# EAGLE design controller (EAGLE 6.1)
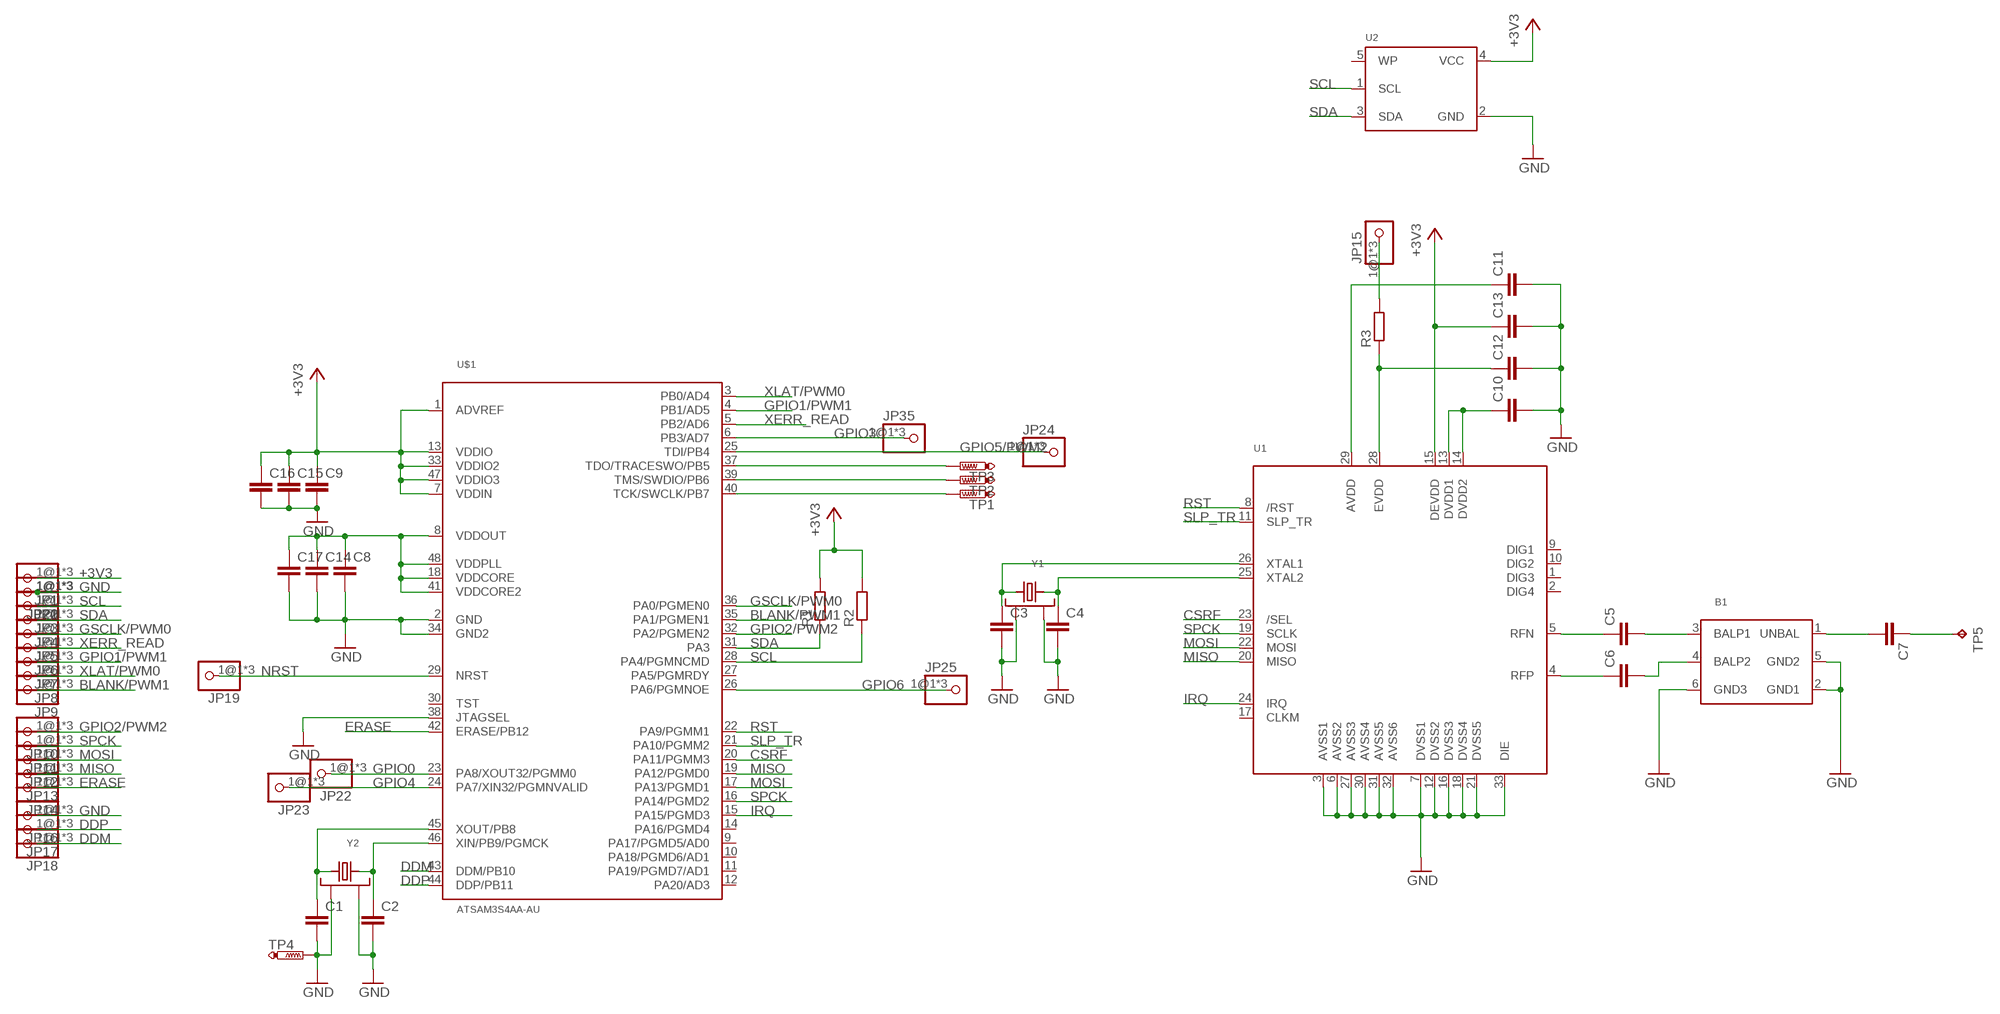
[diagram p0: schematic, sheet 1]

## Parts
B1  BALUN+LP  [BALUN0805]
C1  C-EUC0402K  [C0402K]
C2  C-EUC0402K  [C0402K]
C3  C-EUC0402K  [C0402K]
C4  C-EUC0402K  [C0402K]
C5  C-EUC0402K  [C0402K]
C6  C-EUC0402K  [C0402K]
C7  C-EUC0402K  [C0402K]
C8  C-EUC0603K  [C0603K]
C9  C-EUC0603K  [C0603K]
C10  C-EUC0603K  [C0603K]
C11  C-EUC0603K  [C0603K]
C12  C-EUC0603K  [C0603K]
C13  C-EUC0603K  [C0603K]
C14  C-EUC0603K  [C0603K]
C15  C-EUC0603K  [C0603K]
C16  C-EUC0603K  [C0603K]
C17  C-EUC0805K  [C0805K]
JP1  HEADER-1X1PAD  [1MMPAD]
JP2  HEADER-1X1PAD  [1MMPAD]
JP3  HEADER-1X1PAD  [1MMPAD]
JP4  HEADER-1X1PAD  [1MMPAD]
JP5  HEADER-1X1PAD  [1MMPAD]
JP6  HEADER-1X1PAD  [1MMPAD]
JP7  HEADER-1X1PAD  [1MMPAD]
JP8  HEADER-1X1PAD  [1MMPAD]
JP9  HEADER-1X1PAD  [1MMPAD]
JP10  HEADER-1X1PAD  [1MMPAD]
JP11  HEADER-1X1PAD  [1MMPAD]
JP12  HEADER-1X1PAD  [1MMPAD]
JP13  HEADER-1X1PAD  [1MMPAD]
JP14  HEADER-1X1PAD  [1MMPAD]
JP15  HEADER-1X1PAD  [1MMPAD]
JP16  HEADER-1X1PAD  [1MMPAD]
JP17  HEADER-1X1PAD  [1MMPAD]
JP18  HEADER-1X1PAD  [1MMPAD]
JP19  HEADER-1X1PAD  [1MMPAD]
JP20  HEADER-1X1PAD  [1MMPAD]
JP21  HEADER-1X1PAD  [1MMPAD]
JP22  HEADER-1X1PAD  [1MMPAD]
JP23  HEADER-1X1PAD  [1MMPAD]
JP24  HEADER-1X1PAD  [1MMPAD]
JP25  HEADER-1X1PAD  [1MMPAD]
JP35  HEADER-1X1PAD  [1MMPAD]
R1  R-EU_R0402  [R0402]
R2  R-EU_R0402  [R0402]
R3  R-EU_R0805  [R0805]
TP1  PTR1TP15R  [TP15R]
TP2  PTR1TP15R  [TP15R]
TP3  PTR1TP15R  [TP15R]
TP4  PTR1TP15R  [TP15R]
TP5  TPTP15SQ  [TP15SQ]
U1  AT86RF212  [32QN2]
U2  MCP24AA32  [SOT23-5]
U$1  ATSAM3S4AA-AU  [LQFP48]
Y1  CRYSTALTHIN  [CRYSTAL_3.2X2.5]
Y2  CRYSTALTHIN  [CRYSTAL_3.2X2.5]

## Nets
+3V3: C9.1 C13.1 C15.1 C16.1 JP1.1@1 JP1.1@2 JP1.1@3 R1.2 R2.2 U1.15(DEVDD) U2.4(VCC) U$1.1(ADVREF) U$1.7(VDDIN) U$1.13(VDDIO) U$1.33(VDDIO2) U$1.47(VDDIO3)
ANT: C7.1 TP5.TP
BLANK/PWM1: JP9.1@1 JP9.1@2 JP9.1@3 U$1.35(PA1/PGMEN1)
CSRF: U1.23(/SEL) U$1.20(PA11/PGMM3)
DDM: JP18.1@1 JP18.1@2 JP18.1@3 U$1.43(DDM/PB10)
DDP: JP17.1@1 JP17.1@2 JP17.1@3 U$1.44(DDP/PB11)
ERASE: JP14.1@1 JP14.1@2 JP14.1@3 U$1.42(ERASE/PB12)
GND: B1.2(GND1) B1.5(GND2) B1.6(GND3) C1.2 C2.2 C3.2 C4.2 C8.2 C9.2 C10.2 C11.2 C12.2 C13.2 C14.2 C15.2 C16.2 C17.2 JP2.1@1 JP2.1@2 JP2.1@3 JP16.1@1 JP16.1@2 JP16.1@3 JP20.1@1 JP20.1@2 JP20.1@3 JP21.1@1 JP21.1@2 JP21.1@3 TP4.TP U1.3(AVSS1) U1.6(AVSS2) U1.7(DVSS1) U1.12(DVSS2) U1.16(DVSS3) U1.18(DVSS4) U1.21(DVSS5) U1.27(AVSS3) U1.30(AVSS4) U1.31(AVSS5) U1.32(AVSS6) U1.33(DIE) U2.2(GND) U$1.2(GND) U$1.34(GND2) U$1.38(JTAGSEL) Y1.GND1 Y1.GND2 Y2.GND1 Y2.GND2
GPIO0: JP22.1@1 JP22.1@2 JP22.1@3 U$1.23(PA8/XOUT32/PGMM0)
GPIO1/PWM1: JP7.1@1 JP7.1@2 JP7.1@3 U$1.4(PB1/AD5)
GPIO2/PWM2: JP10.1@1 JP10.1@2 JP10.1@3 U$1.32(PA2/PGMEN2)
GPIO3: JP35.1@1 JP35.1@2 JP35.1@3 U$1.6(PB3/AD7)
GPIO4: JP23.1@1 JP23.1@2 JP23.1@3 U$1.24(PA7/XIN32/PGMNVALID)
GPIO5/PWM2: JP24.1@1 JP24.1@2 JP24.1@3 U$1.25(TDI/PB4)
GPIO6: JP25.1@1 JP25.1@2 JP25.1@3 U$1.26(PA6/PGMNOE)
GSCLK/PWM0: JP5.1@1 JP5.1@2 JP5.1@3 U$1.36(PA0/PGMEN0)
IRQ: U1.24(IRQ) U$1.15(PA15/PGMD3)
MISO: JP13.1@1 JP13.1@2 JP13.1@3 U1.20(MISO) U$1.19(PA12/PGMD0)
MOSI: JP12.1@1 JP12.1@2 JP12.1@3 U1.22(MOSI) U$1.17(PA13/PGMD1)
N$1: C5.1 U1.5(RFN)
N$2: B1.3(BALP1) C5.2
N$3: C6.1 U1.4(RFP)
N$4: B1.4(BALP2) C6.2
N$5: C1.1 U$1.45(XOUT/PB8) Y2.2
N$6: C2.1 U$1.46(XIN/PB9/PGMCK) Y2.1
N$7: B1.1(UNBAL) C7.2
N$9: C3.1 U1.26(XTAL1) Y1.2
N$10: C4.1 U1.25(XTAL2) Y1.1
N$13: C12.1 R3.1 U1.28(EVDD)
N$14: C8.1 C14.1 C17.1 U$1.8(VDDOUT) U$1.18(VDDCORE) U$1.41(VDDCORE2) U$1.48(VDDPLL)
N$15: C11.1 U1.29(AVDD)
N$16: JP15.1@1 JP15.1@2 JP15.1@3 R3.2
N$18: C10.1 U1.13(DVDD1) U1.14(DVDD2)
N$26: TP1.TP U$1.40(TCK/SWCLK/PB7)
N$27: TP2.TP U$1.39(TMS/SWDIO/PB6)
N$28: TP3.TP U$1.37(TDO/TRACESWO/PB5)
NRST: JP19.1@1 JP19.1@2 JP19.1@3 U$1.29(NRST)
RST: U1.8(/RST) U$1.22(PA9/PGMM1)
SCL: JP3.1@1 JP3.1@2 JP3.1@3 R2.1 U2.1(SCL) U$1.28(PA4/PGMNCMD)
SDA: JP4.1@1 JP4.1@2 JP4.1@3 R1.1 U2.3(SDA) U$1.31(PA3)
SLP_TR: U1.11(SLP_TR) U$1.21(PA10/PGMM2)
SPCK: JP11.1@1 JP11.1@2 JP11.1@3 U1.19(SCLK) U$1.16(PA14/PGMD2)
XERR_READ: JP6.1@1 JP6.1@2 JP6.1@3 U$1.5(PB2/AD6)
XLAT/PWM0: JP8.1@1 JP8.1@2 JP8.1@3 U$1.3(PB0/AD4)
Unconnected: U1.1(DIG3) U1.2(DIG4) U1.9(DIG1) U1.10(DIG2) U1.17(CLKM) U2.5(WP) U$1.9(PA17/PGMD5/AD0) U$1.10(PA18/PGMD6/AD1) U$1.11(PA19/PGMD7/AD1) U$1.12(PA20/AD3) U$1.14(PA16/PGMD4) U$1.27(PA5/PGMRDY) U$1.30(TST)

## Library data of the parts
B1 = xtort:BALUN+LP: Balun + Low Pass Filter 0805 863-928 MHz Balun + Low Pass Filter (0805) - Digikey: 712-1473-1-ND
C1-C17 = rcl:C-EU: CAPACITOR, European symbol
JP1-JP25 JP35 = xtort:HEADER-1X1: PIN HEADER
R1-R3 = rcl:R-EU_: RESISTOR, European symbol
TP1-TP4 = testpad:PTR1: TEST PIN
TP5 = testpad:TP: Test pad
U1 = xtort:AT86RF212: AT86RF212 - Low-Power SPI-based 700/800/900 MHz Transceiver Digikey: AT86RF212-ZU-ND
U2 = xtort:MCP24AA32: Microchip 32K (4K x 8) 1.8V I2C EEPROM SOT23-5 [Digikey: 24AA32AFT-I/OTCT-ND]
U$1 = xtort:ATSAM3S4AA-AU
Y1 Y2 = xtort:CRYSTAL: Crystals HC49UP - Surface Mount Crystal 4.0MHz 18pF +/-30ppm Surface Mount Crystal [Digikey: 535-9857-1-ND] 12.0 MHz Surface Mount Crystal [Digikey: 535-9869-6-ND] 25.0 MHz Surface Mount Crystal [Digikey: 535-9078-1-ND] 3.2 x 2.5mm - MEMs SMT Crystal 12.0 MHz 8pF 15ppm 3.2 x 2.5mm Crystal [Digikey: -10-70°C: 644-1047-1-ND -40-125°C: 644-1128-1-ND] 16.0 MHz 8pF 15ppm 3.2 x 2.5mm Crystal [Digikey: -10-70°C: 644-1049-1-ND -40-125°C: 644-1129-2-ND] 16.0 MHz 10pF 10ppm 3.2 x 2.5mm Crystal [Digikey: 644-1100-1-ND] 27.12 MHz 18pF 30ppm 3.2 x 2.5mm Crystal [Digikey: 887-1424-1-ND] 27.12MHz 10pF 10ppm 3.2 x 2.5mm Crystal [Digikey: 887-1329-1-ND] 4.9 x 1.8mm - MEMs SMT Crystal 32.768 KHz 12.5pF 20ppm 4.9 x 1.8mm Crystal [Digikey: SE2415CT-ND] Cylinder 32.768KHz Cylinder Crystal

## Board
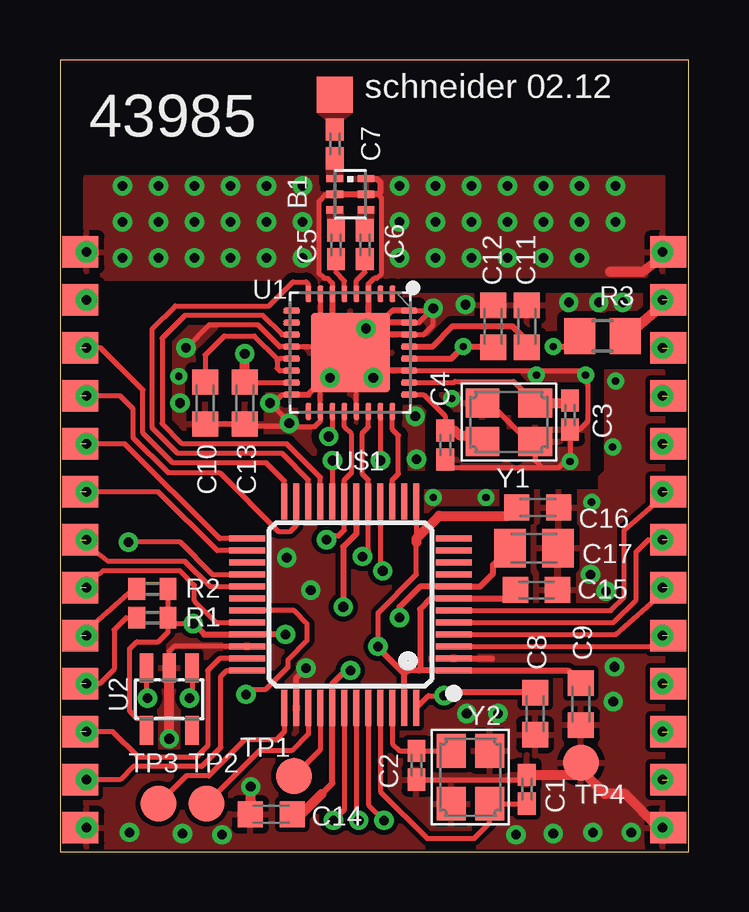
[diagram p1: board, top side]
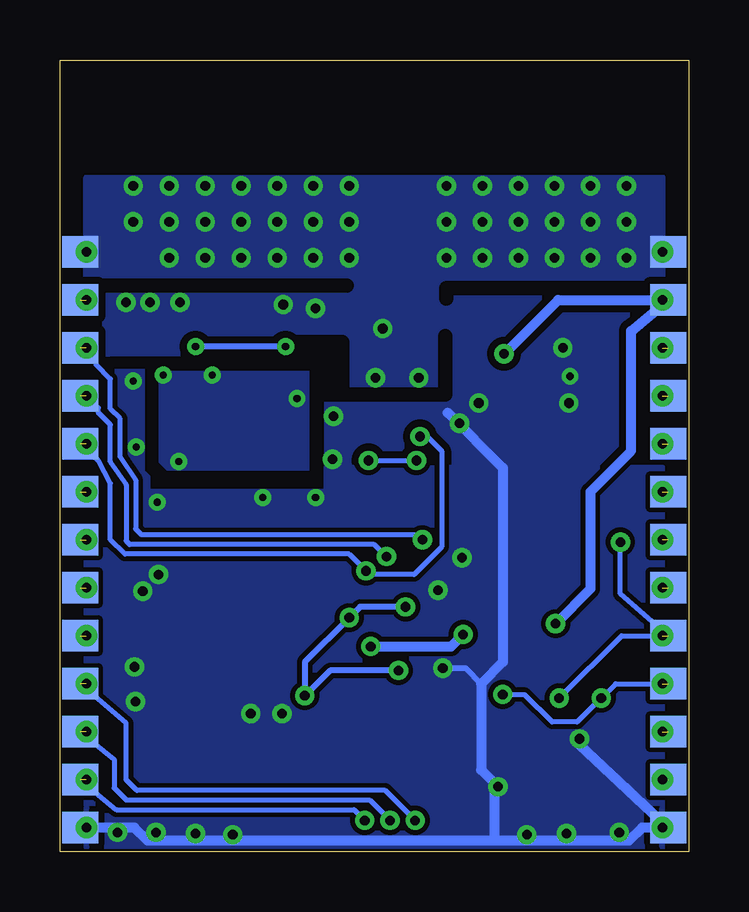
[diagram p2: board, bottom side, seen from below]

Size 26.2 x 33 mm. Coordinates in mm from the lower left corner, seen from the top.
Outline: 0,0 26.2,0 26.2,33 0,33 0,0
Copper layers (1*16): Top 0.035mm / dielectric 1.5mm / Bottom 0.035mm
Design rules: minimum track width 0.2mm, minimum drill 0.3mm, track to track 0.2mm, track to pad 0.2mm, pad to pad 0.2mm, via to via 0.2mm, smd to smd 0.2mm, copper to edge 0.1mm, drill to drill 8mil, minimum pad ring 10mil, minimum via ring 8mil, stop-mask expansion 0.07mm, vias tented up to drill 0.5mm, thermal gap 10mil
tRestrict: 18 lines
bRestrict: 19 lines

### Footprints (pad centres in the part's own frame; a part is rotated, then mirrored left to right if it is on the bottom)
BALUN0805 = smd 0.3 x 0.7: 1 0.65,0.65; 2 0,0.65; 3 -0.65,0.65; 4 -0.65,-0.65; 5 0,-0.65; 6 0.65,-0.65
C0402K = smd 0.925 x 0.74: 1 -0.6,0; 2 0.6,0
C0603K = smd 1.05 x 1.08: 1 -0.875,0; 2 0.875,0
C0805K = smd 1.3 x 1.6: 1 -1,0; 2 1,0
1MMPAD = smd 1.5 x 1.3: 1@1 -0.25,0 | drill 0.4: 1@2 0,0 | smd 1.5 x 1.3 bottom: 1@3 -0.25,0
R0402 = smd 0.7 x 0.9: 1 -0.65,0; 2 0.65,0
R0805 = smd 1.3 x 1.5: 1 -0.95,0; 2 0.95,0
TP15R = smd 1.5 x 1.5: TP 0,0
TP15SQ = smd 1.5 x 1.5: TP 0,0
32QN2 = smd 0.7 x 0.25: 1 -2.45,1.75; 2 -2.45,1.25; 3 -2.45,0.75; 4 -2.45,0.25; 5 -2.45,-0.25; 6 -2.45,-0.75; 7 -2.45,-1.25; 8 -2.45,-1.75; 17 2.45,-1.75; 18 2.45,-1.25; 19 2.45,-0.75; 20 2.45,-0.25; 21 2.45,0.25; 22 2.45,0.75; 23 2.45,1.25; 24 2.45,1.75 | smd 0.25 x 0.7: 9 -1.75,-2.45; 10 -1.25,-2.45; 11 -0.75,-2.45; 12 -0.25,-2.45; 13 0.25,-2.45; 14 0.75,-2.45; 15 1.25,-2.45; 16 1.75,-2.45; 25 1.75,2.45; 26 1.25,2.45; 27 0.75,2.45; 28 0.25,2.45; 29 -0.25,2.45; 30 -0.75,2.45; 31 -1.25,2.45; 32 -1.75,2.45 | smd 3.3 x 3.3: 33 0,0
SOT23-5 = smd 0.55 x 1.2: 1 -0.95,-1.3; 2 0,-1.3; 3 0.95,-1.3; 4 0.95,1.3; 5 -0.95,1.3
LQFP48 = smd 1.5 x 0.25: 1 -4.3,2.75; 2 -4.3,2.25; 3 -4.3,1.75; 4 -4.3,1.25; 5 -4.3,0.75; 6 -4.3,0.25; 7 -4.3,-0.25; 8 -4.3,-0.75; 9 -4.3,-1.25; 10 -4.3,-1.75; 11 -4.3,-2.25; 12 -4.3,-2.75; 25 4.3,-2.75; 26 4.3,-2.25; 27 4.3,-1.75; 28 4.3,-1.25; 29 4.3,-0.75; 30 4.3,-0.25; 31 4.3,0.25; 32 4.3,0.75; 33 4.3,1.25; 34 4.3,1.75; 35 4.3,2.25; 36 4.3,2.75 | smd 0.25 x 1.5: 13 -2.75,-4.3; 14 -2.25,-4.3; 15 -1.75,-4.3; 16 -1.25,-4.3; 17 -0.75,-4.3; 18 -0.25,-4.3; 19 0.25,-4.3; 20 0.75,-4.3; 21 1.25,-4.3; 22 1.75,-4.3; 23 2.25,-4.3; 24 2.75,-4.3; 37 2.75,4.3; 38 2.25,4.3; 39 1.75,4.3; 40 1.25,4.3; 41 0.75,4.3; 42 0.25,4.3; 43 -0.25,4.3; 44 -0.75,4.3; 45 -1.25,4.3; 46 -1.75,4.3; 47 -2.25,4.3; 48 -2.75,4.3
CRYSTAL_3.2X2.5 = smd 1.4 x 1.2: 1 -1.1,-0.8; 2 1.1,0.8; GND1 -1.1,0.8; GND2 1.1,-0.8

### Placement (x,y rotation side)
B1  12.1,27.4 90 top
C1  19.45,2.6 90 top
C2  14.85,3.6 270 top
C3  21.25,18.2 270 top
C4  16.05,16.95 270 top
C5  11.5,25.3 90 top
C6  12.7,25.3 90 top
C7  11.45,29.5 270 top
C8  19.8,5.75 270 top
C9  21.7,6.15 270 top
C10  6.05,18.7 270 top
C11  19.45,21.9 90 top
C12  18.05,21.9 90 top
C13  7.7,18.7 270 top
C14  8.8,1.55 180 top
C15  19.85,10.9 0 top
C16  19.9,14.35 0 top
C17  19.75,12.65 0 top
JP1  1.1,23 0 top
JP2  25.1,25 180 top
JP3  1.1,9 0 top
JP4  1.1,7 0 top
JP5  1.1,3 0 top
JP6  25.1,13 180 top
JP7  25.1,11 180 top
JP8  25.1,9 180 top
JP9  1.1,5 0 top
JP10  1.1,11 0 top
JP11  25.1,17 180 top
JP12  25.1,19 180 top
JP13  25.1,21 180 top
JP14  25.1,7 180 top
JP15  25.1,23 180 top
JP16  1.1,25 0 top
JP17  25.1,3 180 top
JP18  25.1,5 180 top
JP19  1.1,13 0 top
JP20  1.1,1 0 top
JP21  25.1,1 180 top
JP22  1.1,19 0 top
JP23  1.1,21 0 top
JP24  1.1,17 0 top
JP25  1.1,15 0 top
JP35  25.1,15 180 top
R1  3.85,9.75 0 top
R2  3.85,10.95 0 top
R3  22.6,21.5 0 top
TP1  9.75,3.15 0 top
TP2  6.1,2 0 top
TP3  4.1,2 0 top
TP4  21.7,3.7 0 top
TP5  11.45,31.55 0 top
U1  12.1,20.8 270 top
U2  4.55,6.35 180 top
U$1  12.1,10.3 180 top
Y1  18.7,17.9 0 top
Y2  17.1,3.1 270 top

### Tracks (layer width: path | path; a pad name or v marks a point on that pad's centre or on a via)
+3V3  (via drill 0.4)  (1 unrouted)
  Top 0.2: U1.15 7.72,19.55 C13.1 7.65,19.62 | U$1.13 14.85,12.9 14.85,11.55 13.25,9.95 v13.25,8.55 | R1.2 R2.2 | U2.4 3.6,5.55 3.2,5.55 2.9,5.85 2.9,8.45 3.2,8.75 4.1,8.75 4.5,9.15 R1.2 | v5.55,9.5 4.75,9.5 R1.2 | JP1.1@3 JP1.1@2
  Top 0.254: U$1.47 14.35,7.4 | 14.95,7.55 U$1.1 21.18,7.55 C9.1 | 14.95,7.55 14.5,7.55 14.35,7.4 | v13.25,8.55 13.25,8.5 14.35,7.4 | 14.95,7.55 15,7.6 15,10.1 15.45,10.55 U$1.7 18.62,10.55 C15.1 | v9.4,9.05 U$1.33 6,9.05 v5.55,9.5
  Top 0.406: C13.1 v7.7,20.75 | 14.85,12.9 14.85,13.05 15.8,14 18.68,14 C16.1
  Bottom 0.406: v13.25,8.55 9.9,8.55 v9.4,9.05 | v7.7,20.75 5.45,23 JP1.1@3 2.4,21.7 2.4,16.7 4.1,15 4.1,10.95 v5.55,9.5
ANT
  pour Top (no thermals): 10.7,30.8 11.08,30.51 11.08,30.5 11.82,30.5 11.82,30.51 12.2,30.8 12.2,30.81 10.7,30.81
BLANK/PWM1  (2 unrouted)
  Top 0.2: U$1.35 6.65,8.05 6.15,7.55 6.15,4.4 5.7,3.95 3.25,3.95 2.2,5 JP9.1@3
CSRF  (via drill 0.4)
  Top 0.2: U1.23 v13.35,16.3 | v11.35,16.3 U$1.20
  Bottom 0.2: v13.35,16.3 v11.35,16.3
DDM  (via drill 0.4)  (2 unrouted)
  Top 0.2: U$1.43 12.35,1.4 v12.45,1.3
  Bottom 0.2: JP18.1@3 23.95,3.85 23.95,2.65 23.45,2.15 13.3,2.15 v12.45,1.3
DDP  (via drill 0.4)  (2 unrouted)
  Top 0.2: U$1.44 12.85,1.95 v13.5,1.3
  Bottom 0.2: JP17.1@3 23.85,1.75 13.95,1.75 v13.5,1.3
ERASE  (via drill 0.4)  (2 unrouted)
  Top 0.2: U$1.42 11.85,1.75 v11.4,1.3
  Bottom 0.2: v11.4,1.3 12.65,2.55 23,2.55 23.45,3 23.45,5.35 JP14.1@3
GND  (via drill 0.3, 0.4)
  Top 0.2: 9.7,17.75 9.75,17.7 10.6,17.7 10.85,17.95 U1.18 10.85,19.55 11,19.7 U1.33 | 9.7,17.75 9.05,18.4 9.05,18.85 9.25,19.05 U1.16 | U1.33 11.85,21.05 U1.12 9.15,21.05 8.25,21.95 6.2,21.95 v5.25,21 | 11.03,21.88 10.85,22.05 U1.7 10.8,23.3 | 11.1,21.8 U1.33 | 11.35,21.55 U1.33 | 12.85,21.55 12.85,22 12.9,22.05 | 12.85,21.55 U1.33 | 12.85,20.05 U1.33 | U1.21 12.35,20.55 U1.33 | 13.85,22.55 13.32,22.02 12.97,21.68 12.85,21.55 | 12.85,23.65 13.1,23.9 13.2,23.9 13.4,24.1 13.4,27.25 13.25,27.4 | B1.2 11.1,27.4 10.8,27.1 10.8,24.1 11,23.9 11.15,23.9 11.35,23.7 U1.6 | C10.2 C13.2 7.78,17.75 9.7,17.75 | 20.1,16 20.75,16 21.25,16.5 C3.2 21.65,17.6 22,17.95 22,19.55 | 20.1,16 16.4,16 C4.2 | U$1.34 4.75,8.55 4.55,8.35 U2.2 | C2.2 19.25,3 C1.2 | Y1.GND2 19.8,17.05 | 19.8,17.05 19.8,16.3 20.1,16 | U1.27 19.65,20.05 | 19.65,20.05 v19.85,19.85 | 19.65,20.05 22.05,20.05 | 19.8,17.05 19.65,17.05 19.2,17.5 | 19.8,17.05 19.45,17.4 19.2,17.4 17.95,18.65 17.55,18.65 | 14.4,21.55 15.15,21.55 15.55,21.95 v15.55,22.65 | 14.4,22.05 14.95,22.05 v15.55,22.65 | 14.45,22.55 15.45,22.55 v15.55,22.65
  Top 0.254: B1.2 B1.5 13.25,27.4 13.35,27.5 13.35,27.9 13.2,28.05 B1.6 | U$1.2 18,8.05 | U$1.38 9.85,7.25 v10.25,7.65 | U1.6 11.35,22.2 11.03,21.88 | 12.85,23.65 U1.3 12.85,22.1 | U1.32 14.45,22.55 13.85,22.55 | U1.31 14.4,22.05 13.35,22.05 13.32,22.02 | U1.30 14.4,21.55 13.1,21.55 12.97,21.68 | U1.27 12.85,20.05 | U1.16 10.35,19.05 11,19.7
  Top 0.406: 7.95,2.08 v7.95,2.7 | v4.55,4.7 U2.2 | C1.2 21.9,3.2 22.7,2.4 23.55,2.4 24.95,1 JP21.1@3 | 11.03,21.88 11.1,21.8 | 22.93,24.18 24.27,24.18 JP2.1@3
  Bottom 0.254: v10.25,7.65 9.3,7.65 8.65,7
  Bottom 0.406: 8.1,0.45 2.5,0.45 1.95,1 JP20.1@3 4.55,4.45 v4.55,4.7 | 8.1,0.45 22.55,0.45 23.1,1 JP21.1@3 | 8.1,0.45 8.1,2.55 v7.95,2.7 8.65,3.4 8.65,7 7.75,7.9 7.75,16 10.05,18.3
  other vias: 22.1,11.55 10.1,27.75 22.45,22.9 14.85,16.35 14.8,18.15 9.55,17.85 22.2,0.8 19,0.7 2.9,0.8 21.2,22.9 12.75,21.8 13.05,19.75 11.25,19.75 5,18.7 8.75,18.7 23.45,22.9 10.1,26.25 10.1,24.75 8.6,24.75 7.1,24.75 5.6,24.75 4.1,24.75 2.6,24.75 2.6,26.25 4.1,26.25 5.6,26.25 7.1,26.25 8.6,26.25 8.6,27.75 7.1,27.75 14.15,27.75 5.6,27.75 4.1,27.75 2.6,27.75 15.65,27.75 17.15,27.75 18.65,27.75 20.15,27.75 21.65,27.75 23.15,27.75 23.15,26.25 21.65,26.25 20.15,26.25 18.65,26.25 17.15,26.25 15.65,26.25 20.15,24.75 14.15,26.25 14.15,24.75 21.65,24.75 15.65,24.75 17.15,24.75 18.65,24.75 21.9,19.86 4.95,19.81 21.25,16.26 16.32,18.89 16.9,22.8 23.15,19.61 23.02,16.86 22.15,14.56 17.75,14.76 15.55,14.76 5.1,0.75 6.75,0.7 20.55,0.75 23.8,0.8 23.05,6.25 23.1,7.7 22.75,10.85 9.45,12.25 10.45,10.9 18.25,5.75 16.95,5.75
  pour Bottom: 1.1,-2 1.1,16 15.1,16 15.1,15 22.55,15 22.55,20 25.1,20 25.1,-2
  pour Bottom (isolate 0.3, no thermals): 1.1,16 25.1,16 25.1,28.1 1.1,28.1
  pour Top (isolate 0.3): 1.1,28.1 25.1,28.1 25.1,16 1.1,16
  pour Top: 1.1,15 22.55,15 22.55,20 25.1,20 25.1,-2 1.1,-2
GPIO0  (2 unrouted)
  Top 0.2: U$1.23 9.85,13.6 9.6,13.35 9.1,13.35 6.65,15.8 4.5,15.8 3.05,17.25 3.05,18.45 2.5,19 JP22.1@3
GPIO1/PWM1  (2 unrouted)
  Top 0.2: U$1.4 23.15,9.05 JP7.1@3
GPIO2/PWM2  (2 unrouted)
  Top 0.2: U$1.32 6.5,9.55 5.6,10.45 5.6,11.1 5,11.7 1.8,11.7 JP10.1@3
GPIO3  (2 unrouted)
  Top 0.2: JP35.1@3 23.5,13.4 23.5,10.6 22.95,10.05 U$1.6
GPIO4  (2 unrouted)
  Top 0.2: U$1.24 9.35,15.45 8.6,16.2 4.7,16.2 3.45,17.45 3.45,19.25 1.7,21 JP23.1@2
GPIO5/PWM2  (2 unrouted)
  Top 0.2: U$1.25 6.65,13.05 2.7,17 JP24.1@3
GPIO6  (2 unrouted)
  Top 0.2: U$1.26 6.55,12.55 4.1,15 JP25.1@3
GSCLK/PWM0  (1 unrouted)
  Top 0.2: U$1.36 6.95,7.55 6.7,7.3 6.7,4.35 5.9,3.55 3.05,3.55 2.5,3 JP5.1@3
  Bottom 0.2: JP5.1@3 JP5.1@2
IRQ
  Top 0.2: U$1.15 13.85,15.5 14.1,15.75 14.1,17.35 13.85,17.6 U1.24
MISO  (via drill 0.4)  (2 unrouted)
  Top 0.2: U1.20 11.85,17.7 12.15,17.4 12.15,15.8 11.85,15.5 U$1.19 11.85,13.4 11.6,13.15 11.25,13.15 v11.1,13
  Bottom 0.2: v11.1,13 11.3,13.2 22.8,13.2 23.05,13.45 23.05,15.5 23.7,16.45 23.7,18.05 24.1,18.45 24.1,19.7 24.7,20.3 24.7,20.6 JP13.1@3
MOSI  (via drill 0.4)  (2 unrouted)
  Top 0.2: U1.22 12.85,17.7 12.6,17.45 12.6,15.75 12.85,15.5 U$1.17 12.85,12.55 v12.6,12.3
  Bottom 0.2: JP12.1@3 24.6,18.5 24.6,18.3 24.1,17.8 24.1,16.25 23.45,15.3 23.45,12.95 23.3,12.8 13.1,12.8 v12.6,12.3
N$1
  Top 0.2: U1.5 11.85,23.8 11.5,24.15 C5.1
N$2
  Top 0.2: 11.5,26.7 B1.3
  pour Top (no thermals): 11.13,26.36 11.1,26.6 11.1,26.61 11.8,26.61 11.8,26.6 11.87,26.36 11.87,26.35 11.13,26.35
N$3
  Top 0.2: U1.4 12.35,23.8 12.7,24.15 C6.1
N$4
  Top 0.2: 12.7,26.7 B1.4
  pour Top (no thermals): 12.33,26.36 12.4,26.6 12.4,26.61 13.1,26.61 13.1,26.6 13.07,26.36 13.07,26.35 12.33,26.35
N$5
  Top 0.2: U$1.45 13.35,2.5 15.3,0.55 17.25,0.55 17.9,1.2 Y2.2 C1.1
N$6
  Top 0.2: U$1.46 13.85,4.5 14.15,4.2 C2.1 Y2.1
N$7
  Top 0.254: B1.1 11.55,28.05
  pour Top (no thermals): 11.08,28.44 11.1,28.2 11.1,28.19 11.8,28.19 11.8,28.2 11.82,28.44 11.82,28.45 11.08,28.45
N$9
  Top 0.2: U1.26 16.4,19.55 16.45,19.6 18.9,19.6 Y1.2
  Top 0.406: Y1.2 21.15,18.7 C3.1
N$10
  Top 0.2: 17.15,17.55 Y1.1 | C4.1 16.05,18.15 15.15,19.05 U1.25
  Top 0.406: C4.1 16.45,17.55 16.65,17.35 17.35,17.35 Y1.1
N$13  (via drill 0.3)
  Top 0.254: U1.28 16.3,20.55 v16.8,21.05 18.05,21.05 | 18.05,21.05 18.1,21.05 | C12.1 18.05,21.05 | v20.55,21.05 21.2,21.05 R3.1
  Bottom 0.254: v16.8,21.05 v20.55,21.05
N$14  (via drill 0.4)
  Top 0.2: U$1.8 17.2,11.05 | U$1.48 15.35,6.5 v16,6.5 | C8.1 19.8,6.65
  Top 0.254: 10.9,2.4 11.35,2.85 U$1.41 11.35,7 11.9,7.55 v12.1,7.55 | v16,6.5 16.25,6.5 16.4,6.65 19.8,6.65 | U$1.8 15,11.05 14.15,10.2 v14.15,9.75 | U$1.18 12.35,13.25 11.8,12.7 v11.8,10.2 | 17.2,11.05 17.5,11.05 18.05,11.6 18.05,11.95 C17.1
  Top 0.406: 10.9,2.4 10.05,1.55 C14.1
  Bottom 0.254: v11.8,10.2 13.7,10.2 v14.15,9.75 16,7.9 v16,6.5 14.95,7.55 v12.1,7.55
N$15
  Top 0.254: U1.29 15.5,21.05 16.35,21.9 18.85,21.9 19.45,21.3 C11.1 19.45,21
N$16  (2 unrouted)
  Top 0.406: R3.2 23.6,21.5 JP15.1@3
N$18
  Top 0.2: U1.13 9.15,20.55 | 9.15,20.55 9.05,20.45 9.05,20.15 9.15,20.05 U1.14 | 6.05,19.62 C10.1 6.05,20.7 6.85,21.5 8.1,21.5 9.05,20.55 9.15,20.55
N$26
  Top 0.2: U$1.40 10.85,4.25 TP1.TP
N$27
  Top 0.2: U$1.39 10.35,4.9 9.65,4.2 8.3,4.2 TP2.TP
N$28
  Top 0.2: U$1.37 9.35,5 9,4.65 7.7,4.65 6.2,3.15 5.25,3.15 TP3.TP
NRST  (2 unrouted)
  Top 0.2: U$1.29 6.25,11.05 5.2,12.1 2,12.1 JP19.1@3
RST
  Top 0.2: U$1.22 10.35,15.5 9.25,16.6 4.9,16.6 3.85,17.65 3.85,21.8 4.8,22.75 8.7,22.75 9.7,23.75 10.25,23.75 10.35,23.65 U1.8
SCL  (via drill 0.4)  (2 unrouted)
  Top 0.2: 3.15,11 R2.1 3.05,10.95 JP3.1@3 | U$1.28 6.35,11.55 5,12.9 v2.85,12.9 | U2.1 5.5,6.5 v5.4,6.4
  Bottom 0.2: v5.4,6.4 2.8,9 JP3.1@3 2.85,10.75 v2.85,12.9
SDA  (via drill 0.4)  (2 unrouted)
  Top 0.2: U2.3 3.6,6.45 v3.65,6.4 | U$1.31 9.75,10.05 10.3,9.5 10.3,8.8 9.5,8 9.5,7.7 8.55,6.75 7.95,6.75 v7.75,6.55 | JP4.1@3 1.65,7 2.25,7.6 2.25,9.25 2.75,9.75 R1.1
  Bottom 0.2: v7.75,6.55 6.85,6.55 5.7,5.4 4.65,5.4 v3.65,6.4 3.05,7 JP4.1@3
SLP_TR
  Top 0.2: U$1.21 10.85,15.6 9.45,17 5.1,17 4.25,17.85 4.25,21.4 5.2,22.35 8.45,22.35 9.25,21.55 U1.11
SPCK  (via drill 0.4)  (2 unrouted)
  Top 0.2: U1.19 11.35,17.45 v11.2,17.3 | U$1.16 13.35,11.8 v13.45,11.7
  Bottom 0.2: v11.2,17.3 10.9,17.3 10.3,16.7 10.3,12.7 11.45,11.55 13.3,11.55 v13.45,11.7 14.15,12.4 23.5,12.4 24.1,13 24.1,15.35 24.6,16.3 25.1,16.8 JP11.1@2 | 24.7,16.6 JP11.1@3
XERR_READ  (2 unrouted)
  Top 0.2: JP6.1@3 24.5,13 24,12.5 24,10.5 23.05,9.55 U$1.5
XLAT/PWM0  (2 unrouted)
  Top 0.2: U$1.3 24.65,8.55 JP8.1@3

### Text on the board
tPlace: schneider 02.12 | 43985